# EAGLE design lichtenstein_pwm_v2 (EAGLE 9.2.1)

## Sheet 1 of 2
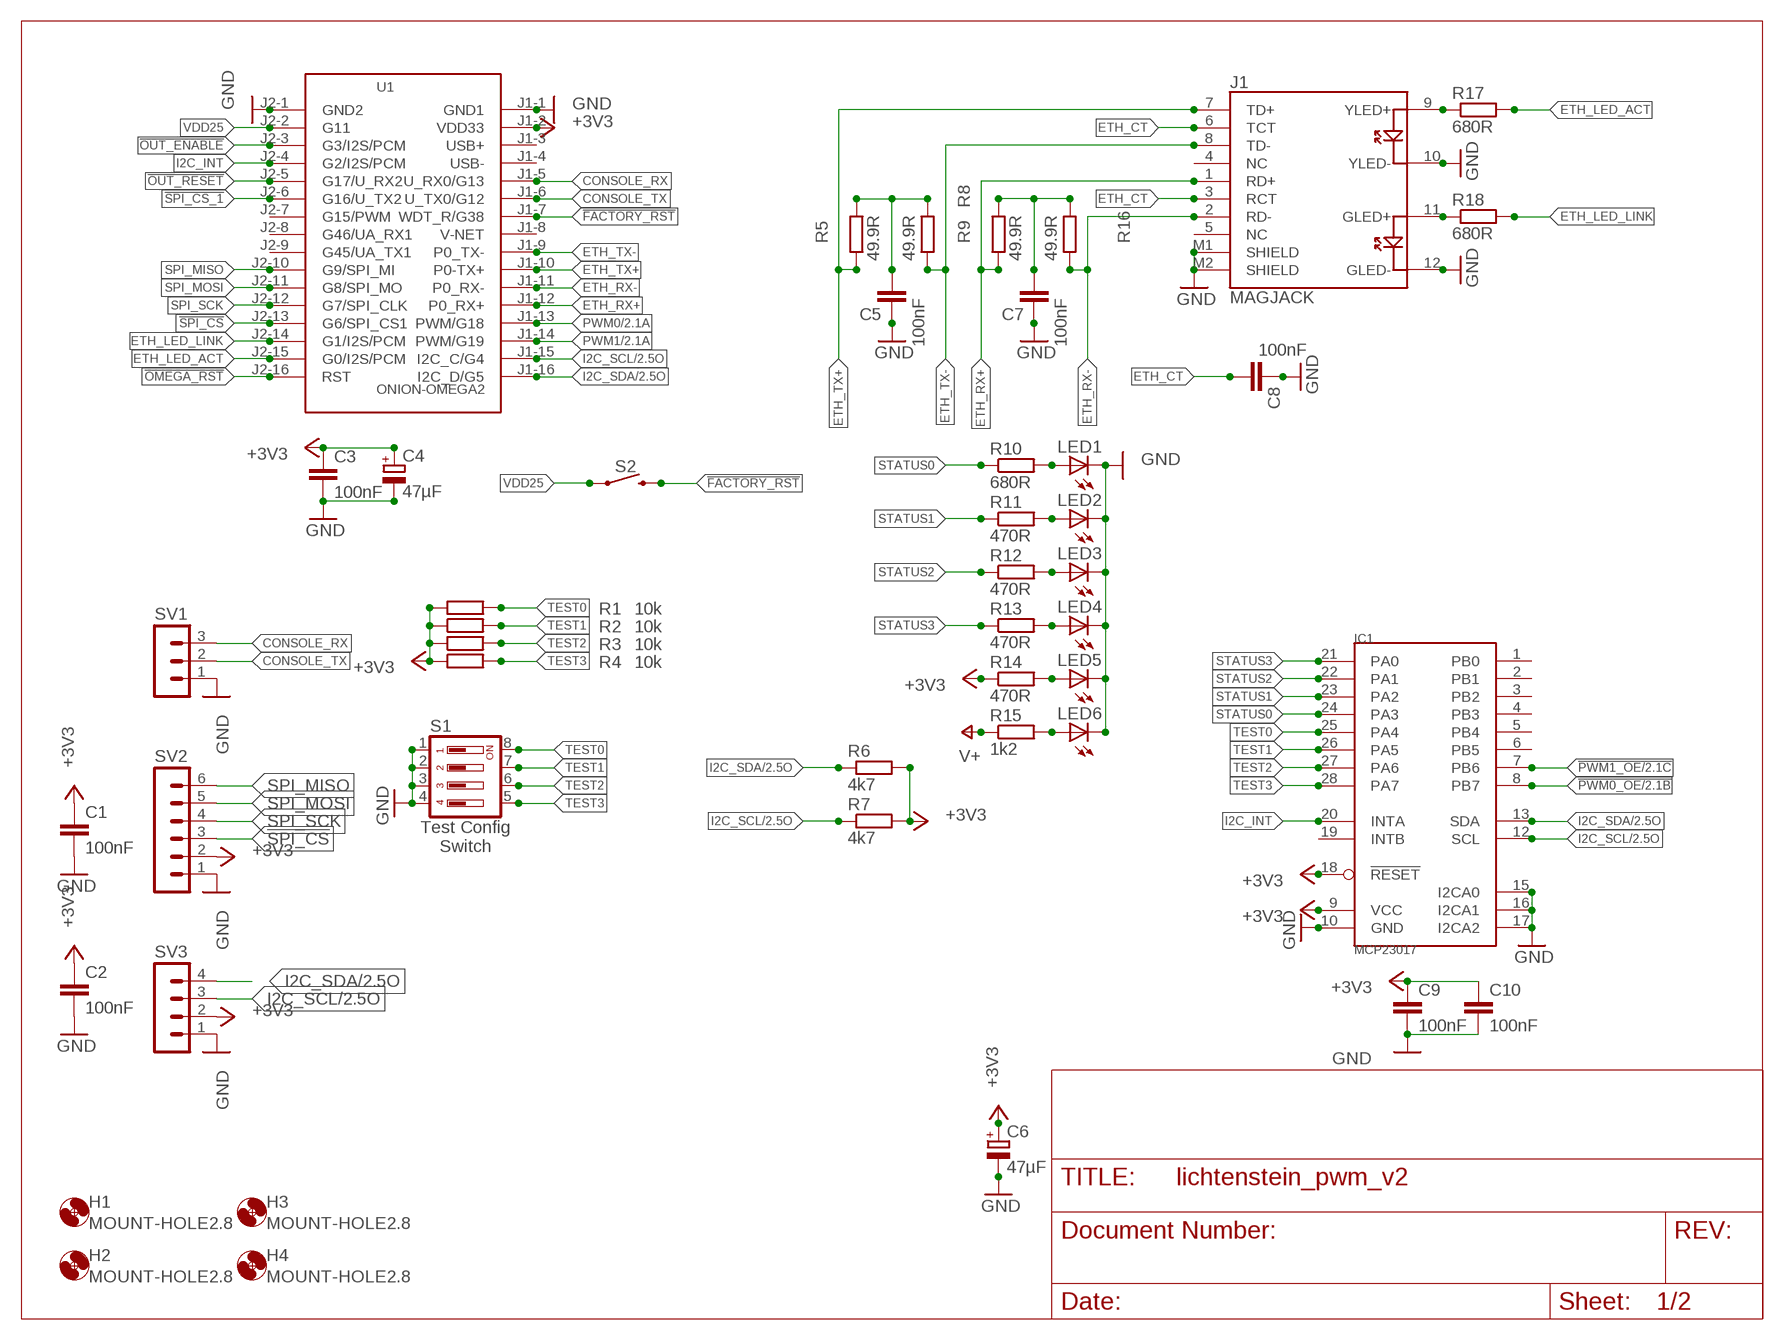
[diagram p0: schematic, sheet 1]

### Parts
C1  100nF  C-EUC0805  [C0805]
C2  100nF  C-EUC0805  [C0805]
C3  100nF  C-EUC0805  [C0805]
C4  47µF  CPOL-EUSMCC  [SMC_C]
C5  100nF  C-EUC0805  [C0805]
C6  47µF  CPOL-EUSMCC  [SMC_C]
C7  100nF  C-EUC0805  [C0805]
C8  100nF  C-EUC0805  [C0805]
C9  100nF  C-EUC0805  [C0805]
C10  100nF  C-EUC0805  [C0805]
H1  MOUNT-HOLE2.8  [2,8]
H2  MOUNT-HOLE2.8  [2,8]
H3  MOUNT-HOLE2.8  [2,8]
H4  MOUNT-HOLE2.8  [2,8]
IC1  MCP23017  MCP23017SOIC28  [SO28W]
J1  MAGJACK  [MAGJACK]
LED1  LEDCHIPLED_1206  [CHIPLED_1206]
LED2  LEDCHIPLED_1206  [CHIPLED_1206]
LED3  LEDCHIPLED_1206  [CHIPLED_1206]
LED4  LEDCHIPLED_1206  [CHIPLED_1206]
LED5  LEDCHIPLED_1206  [CHIPLED_1206]
LED6  LEDCHIPLED_1206  [CHIPLED_1206]
R1  10k  R-EU_M0805  [M0805]
R2  10k  R-EU_M0805  [M0805]
R3  10k  R-EU_M0805  [M0805]
R4  10k  R-EU_M0805  [M0805]
R5  49.9R  R-EU_M0805  [M0805]
R6  4k7  R-EU_M0805  [M0805]
R7  4k7  R-EU_M0805  [M0805]
R8  49.9R  R-EU_M0805  [M0805]
R9  49.9R  R-EU_M0805  [M0805]
R10  680R  R-EU_M0805  [M0805]
R11  470R  R-EU_M0805  [M0805]
R12  470R  R-EU_M0805  [M0805]
R13  470R  R-EU_M0805  [M0805]
R14  470R  R-EU_M0805  [M0805]
R15  1k2  R-EU_M0805  [M0805]
R16  49.9R  R-EU_M0805  [M0805]
R17  680R  R-EU_M0805  [M0805]
R18  680R  R-EU_M0805  [M0805]
S1  219-04  [CTS-219-04]
S2  MOMENTARY-SWITCH-SPST-PTH-6.0MM  [TACTILE_SWITCH_PTH_6.0MM]
SV1  MA03-1  [MA03-1]
SV2  MA06-1  [MA06-1]
SV3  MA04-1  [MA04-1]
U1  ONION-OMEGA2  [ONION-2MM-2X16]

### Nets
!FACTORY_RST: S2.3 U1.J1-7(WDT_R/G38)
!OMEGA_RST: U1.J2-16(RST)
!OUT_ENABLE: U1.J2-3(G3/I2S/PCM)
!OUT_RESET: U1.J2-5(G17/U_RX2)
!PWM0_OE: IC1.8(PB7) ; also sheet 2
!PWM1_OE: IC1.7(PB6) ; also sheet 2
!SPI_CS: SV2.3 U1.J2-13(G6/SPI_CS1)
!SPI_CS_1: U1.J2-6(G16/U_TX2)
+3V3: C1.1 C2.1 C3.1 C4.+ C6.+ C9.1 C10.1 IC1.9(VCC) IC1.18(!RESET) R1.1 R2.1 R3.1 R4.1 R6.2 R7.2 R14.1 SV2.2 SV3.2 U1.J1-2(VDD33) ; also sheet 2
CONSOLE_RX: SV1.3 U1.J1-5(U_RX0/G13)
CONSOLE_TX: SV1.2 U1.J1-6(U_TX0/G12)
ETH_CT: C8.2 J1.3(RCT) J1.6(TCT)
ETH_LED_ACT: R17.2 U1.J2-15(G0/I2S/PCM)
ETH_LED_LINK: R18.2 U1.J2-14(G1/I2S/PCM)
ETH_RX+: J1.1(RD+) R9.1 U1.J1-12(P0_RX+)
ETH_RX-: J1.2(RD-) R16.1 U1.J1-11(P0_RX-)
ETH_TX+: J1.7(TD+) R5.1 U1.J1-10(P0-TX+)
ETH_TX-: J1.8(TD-) R8.1 U1.J1-9(P0_TX-)
GND: C1.2 C2.2 C3.2 C4.- C5.1 C6.- C7.1 C8.1 C9.2 C10.2 IC1.10(GND) IC1.15(I2CA0) IC1.16(I2CA1) IC1.17(I2CA2) J1.10(YLED-) J1.12(GLED-) J1.M1(SHIELD) J1.M2(SHIELD) LED1.C LED2.C LED3.C LED4.C LED5.C LED6.C S1.1 S1.2 S1.3 S1.4 SV1.1 SV2.1 SV3.1 U1.J1-1(GND1) U1.J2-1(GND2) ; also sheet 2
I2C_INT: IC1.20(INTA) U1.J2-4(G2/I2S/PCM)
I2C_SCL: IC1.12(SCL) R7.1 SV3.3 U1.J1-15(I2C_C/G4) ; also sheet 2
I2C_SDA: IC1.13(SDA) R6.1 SV3.4 U1.J1-16(I2C_D/G5) ; also sheet 2
N$1: LED5.A R14.2
N$2: LED1.A R10.2
N$3: C5.2 R5.2 R8.2
N$4: J1.9(YLED+) R17.1
N$5: J1.11(GLED+) R18.1
N$6: C7.2 R9.2 R16.2
N$9: LED2.A R11.2
N$10: LED3.A R12.2
N$11: LED4.A R13.2
N$14: LED6.A R15.2
PWM0: U1.J1-13(PWM/G18) ; also sheet 2
PWM1: U1.J1-14(PWM/G19) ; also sheet 2
SPI_MISO: SV2.6 U1.J2-10(G9/SPI_MI)
SPI_MOSI: SV2.5 U1.J2-11(G8/SPI_MO)
SPI_SCK: SV2.4 U1.J2-12(G7/SPI_CLK)
STATUS0: IC1.24(PA3) R10.1
STATUS1: IC1.23(PA2) R11.1
STATUS2: IC1.22(PA1) R12.1
STATUS3: IC1.21(PA0) R13.1
TEST0: IC1.25(PA4) R1.2 S1.8
TEST1: IC1.26(PA5) R2.2 S1.7
TEST2: IC1.27(PA6) R3.2 S1.6
TEST3: IC1.28(PA7) R4.2 S1.5
V+: R15.1 ; also sheet 2
VDD25: S2.1 U1.J2-2(G11)
Unconnected: IC1.1(PB0) IC1.2(PB1) IC1.3(PB2) IC1.4(PB3) IC1.5(PB4) IC1.6(PB5) IC1.19(INTB) J1.4(NC) J1.5(NC) U1.J1-3(USB+) U1.J1-4(USB-) U1.J1-8(V-NET) U1.J2-7(G15/PWM) U1.J2-8(G46/UA_RX1) U1.J2-9(G45/UA_TX1)

### Notes on the sheet
- Test Config
  Switch

## Sheet 2 of 2
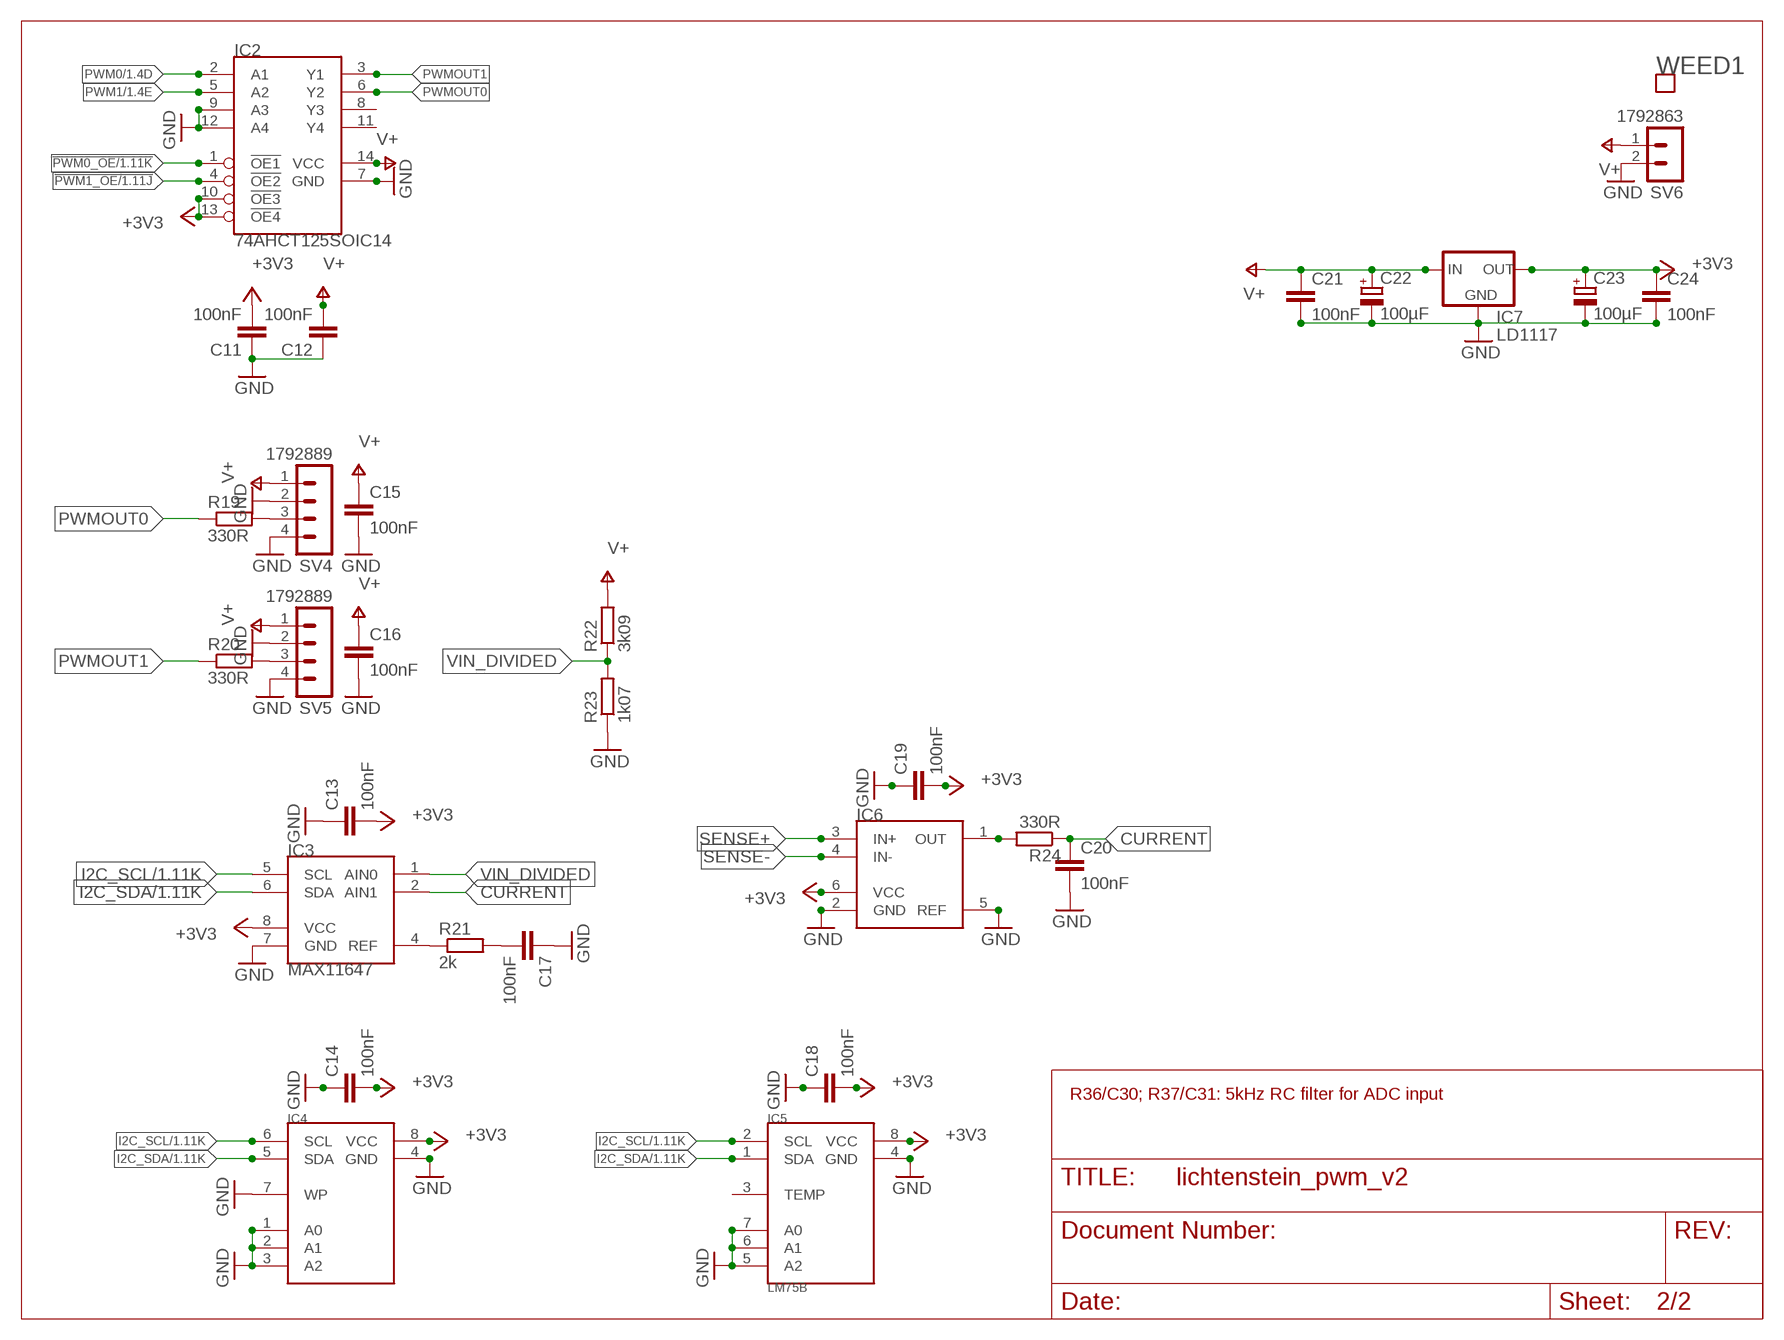
[diagram p1: schematic, sheet 2]

### Parts
C11  100nF  C-EUC0805  [C0805]
C12  100nF  C-EUC0805  [C0805]
C13  100nF  C-EUC0805  [C0805]
C14  100nF  C-EUC0805  [C0805]
C15  100nF  C-EUC0805  [C0805]
C16  100nF  C-EUC0805  [C0805]
C17  100nF  C-EUC0805  [C0805]
C18  100nF  C-EUC0805  [C0805]
C19  100nF  C-EUC0805  [C0805]
C20  100nF  C-EUC0805  [C0805]
C21  100nF  C-EUC0805  [C0805]
C22  100µF  CPOL-EUD  [PANASONIC_D]
C23  100µF  CPOL-EUCT7343  [CT7343]
C24  100nF  C-EUC0805  [C0805]
IC2  74AHCT125SOIC14  [SO14]
IC3  MAX11647  MAX11647UMAX-8  [UMAX8]
IC4  AT24C02DSOIC-8  [SOIC8]
IC5  LM75B  [SOIC8]
IC6  INA18120VVSOT-23  [SOT23-6L]
IC7  LD1117  LD1117TO-220  [TO220V]
R19  330R  R-EU_M0805  [M0805]
R20  330R  R-EU_M0805  [M0805]
R21  2k  R-EU_M0805  [M0805]
R22  3k09  R-EU_M0805  [M0805]
R23  1k07  R-EU_M0805  [M0805]
R24  330R  R-EU_M0805  [M0805]
SV4  1792889  [1792889]
SV5  1792889  [1792889]
SV6  1792863  [1792863]
WEED1  WEED  [DOINK]

### Nets
!PWM0_OE: IC2.1(!OE1) ; also sheet 1
!PWM1_OE: IC2.4(!OE2) ; also sheet 1
+3V3: C11.2 C13.2 C14.2 C18.2 C19.2 C23.+ C24.1 IC2.10(!OE3) IC2.13(!OE4) IC3.8(VCC) IC4.8(VCC) IC5.8(VCC) IC6.6(VCC) IC7.2(OUT) ; also sheet 1
CURRENT: C20.1 IC3.2(AIN1) R24.1
GND: C11.1 C12.1 C13.1 C14.1 C15.2 C16.2 C17.1 C18.1 C19.1 C20.2 C21.2 C22.- C23.- C24.2 IC2.7(GND) IC2.9(A3) IC2.12(A4) IC3.7(GND) IC4.1(A0) IC4.2(A1) IC4.3(A2) IC4.4(GND) IC4.7(WP) IC5.4(GND) IC5.5(A2) IC5.6(A1) IC5.7(A0) IC6.2(GND) IC6.5(REF) IC7.1(GND) R23.1 SV4.2 SV4.4 SV5.2 SV5.4 SV6.2 ; also sheet 1
I2C_SCL: IC3.5(SCL) IC4.6(SCL) IC5.2(SCL) ; also sheet 1
I2C_SDA: IC3.6(SDA) IC4.5(SDA) IC5.1(SDA) ; also sheet 1
N$7: R19.2 SV4.3
N$8: R20.2 SV5.3
N$12: IC3.4(REF) R21.1
N$13: C17.2 R21.2
N$21: IC6.1(OUT) R24.2
PWM0: IC2.2(A1) ; also sheet 1
PWM1: IC2.5(A2) ; also sheet 1
PWMOUT0: IC2.6(Y2) R19.1
PWMOUT1: IC2.3(Y1) R20.1
SENSE+: IC6.3(IN+)
SENSE-: IC6.4(IN-)
V+: C12.2 C15.1 C16.1 C21.1 C22.+ IC2.14(VCC) IC7.3(IN) R22.2 SV4.1 SV5.1 SV6.1 ; also sheet 1
VIN_DIVIDED: IC3.1(AIN0) R22.1 R23.2
Unconnected: IC2.8(Y3) IC2.11(Y4) IC5.3(TEMP)

### Notes on the sheet
- R36/C30; R37/C31: 5kHz RC filter for ADC input

## Library data of the parts
C1-C3 C5 C7-C21 C24 = rcl:C-EU: CAPACITOR, European symbol; MOUSER: 710-885012207072; SPICEPREFIX: C
C4 C6 = rcl:CPOL-EU: POLARIZED CAPACITOR, European symbol; MOUSER: 581-TAJC476K016SNJ; SPICEPREFIX: C
C22 = rcl:CPOL-EU: POLARIZED CAPACITOR, European symbol; MOUSER: 667-EEE-HC1C101XP; SPICEPREFIX: C
C23 = rcl:CPOL-EU: POLARIZED CAPACITOR, European symbol; MOUSER: 581-NOSD107M006; SPICEPREFIX: C
H1-H4 = holes:MOUNT-HOLE: MOUNTING HOLE with drill center marker
IC1 = lichtenstein_onion:MCP23017: MCP23017 – 16-Bit I2C I/O Expander with Serial Interface Footprint Proven Information <https://www.microchip.com/wwwproducts/en/MCP23017> Datasheet <http://ww1.microchip.com/downloads/en/DeviceDoc/20001952C.pdf>; MOUSER: 579-MCP23017-E/SO
IC2 = lichtenstein_onion:74AHCT125: UADRUPLE BUS BUFFER GATES WITH 3-STATE OUTPUTS Datasheet <http://www.ti.com/lit/ds/symlink/sn74ahct125.pdf>; MOUSER: 595-SN74AHCT125D
IC3 = lichtenstein_onion:MAX11647: Low-Power, 1-/2-Channel, I²C, 10-Bit ADC Datasheet <https://datasheets.maximintegrated.com/en/ds/MAX11646-MAX11647.pdf>; MOUSER: 700-MAX11647EUA
IC4 = lichtenstein_onion:AT24C02D: I2C-Compatible (2-wire) Serial EEPROM; 1-Kbit (128 x 8) or 2-Kbit (256 x 8) Footprint Proven Datasheet <http://ww1.microchip.com/downloads/en/DeviceDoc/Atmel-8871F-SEEPROM-AT24C01D-02D-Datasheet.pdf>; MOUSER: 556-AT24C02D-SSHM-T
IC5 = lichtenstein_onion:LM75B: Digital temperature sensor and thermal watchdog Datasheet <https://www.mouser.com/datasheet/2/302/LM75B-1126491.pdf>; MOUSER: 771-LM75BD118
IC6 = lichtenstein_onion:INA181: Bidirectional, Low- and High-Side Voltage Output, Current-Sense Amplifiers Datasheets <http://www.ti.com/lit/ds/symlink/ina181.pdf> Gain Options 20 V/V (INA181A1) 50 V/V (INA181A2) 100 V/V (INA181A3) 200 V/V (INA181A4); MOUSER: 595-INA181A1IDBVR
IC7 = lichtenstein_onion:LD1117: LD1117 Voltage Regulator; MOUSER: 490-VXO7803-500
J1 = SparkFun-Connectors:MAGJACK: MAGJACK: RJ-45 with LEDs This is a single port, RJ45 ethernet jacks with built in transformer (magnetics), status LEDs, and shielding. Here is the connector we sell at SparkFun: RJ45 Ethernet MagJack-Compatible <https://www.sparkfun.com/products/8534> (PRT-08534) Datasheet <http://www.sparkfun.com/datasheets/Prototyping/MagJack.pdf> It is used on this SparkFun product: SparkFun RJ45 MagJack Breakout <https://www.sparkfun.com/products/13021> (BOB-13021); PROD_ID: CONN-09556; SF_ID: PRT-08534
LED1 = led:LED: LED OSRAM: - CHIPLED LG R971, LG N971, LY N971, LG Q971, LY Q971, LO R971, LY R971 LH N974, LH R974 LS Q976, LO Q976, LY Q976 LO Q996 - Hyper CHIPLED LW Q18S LB Q993, LB Q99A, LB R99A - SideLED LS A670, LO A670, LY A670, LG A670, LP A670 LB A673, LV A673, LT A673, LW A673 LH A674 LY A675 LS A676, LA A676, LO A676, LY A676, LW A676 LS A679, LY A679, LG A679 - Hyper Micro SIDELED® LS Y876, LA Y876, LO Y876, LY Y876 LT Y87S - SmartLED LW L88C, LW L88S LB L89C, LB L89S, LG L890 LS L89K, LO L89K, LY L89K LS L896, LA L896, LO L896, LY L896 - TOPLED LS T670, LO T670, LY T670, LG T670, LP T670 LSG T670, LSP T670, LSY T670, LOP T670, LYG T670 LG T671, LOG T671, LSG T671 LB T673, LV T673, LT T673, LW T673 LH T674 LS T676, LA T676, LO T676, LY T676, LB T676, LH T676, LSB T676, LW T676 LB T67C, LV T67C, LT T67C, LS T67K, LO T67K, LY T67K, LW E67C LS E67B, LA E67B, LO E67B, LY E67B, LB E67C, LV E67C, LT E67C LW T67C LS T679, LY T679, LG T679 LS T770, LO T770, LY T770, LG T770, LP T770 LB T773, LV T773, LT T773, LW T773 LH T774 LS E675, LA E675, LY E675, LS T675 LS T776, LA T776, LO T776, LY T776, LB T776 LHGB T686 LT T68C, LB T68C - Hyper Mini TOPLED® LB M676 - Mini TOPLED Santana® LG M470 LS M47K, LO M47K, LY M47K Source: http://www.osram.convergy.de LUXEON: - LUMILED® LXK2-PW12-R00, LXK2-PW12-S00, LXK2-PW14-U00, LXK2-PW14-V00 LXK2-PM12-R00, LXK2-PM12-S00, LXK2-PM14-U00 LXK2-PE12-Q00, LXK2-PE12-R00, LXK2-PE12-S00, LXK2-PE14-T00, LXK2-PE14-U00 LXK2-PB12-K00, LXK2-PB12-L00, LXK2-PB12-M00, LXK2-PB14-N00, LXK2-PB14-P00, LXK2-PB14-Q00 LXK2-PR12-L00, LXK2-PR12-M00, LXK2-PR14-Q00, LXK2-PR14-R00 LXK2-PD12-Q00, LXK2-PD12-R00, LXK2-PD12-S00 LXK2-PH12-R00, LXK2-PH12-S00 LXK2-PL12-P00, LXK2-PL12-Q00, LXK2-PL12-R00 Source: www.luxeon.com KINGBRIGHT: KA-3528ASYC Source: www.kingbright.com; MOUSER: 604-APTR3216SRCPRV
LED2-LED6 = led:LED: LED OSRAM: - CHIPLED LG R971, LG N971, LY N971, LG Q971, LY Q971, LO R971, LY R971 LH N974, LH R974 LS Q976, LO Q976, LY Q976 LO Q996 - Hyper CHIPLED LW Q18S LB Q993, LB Q99A, LB R99A - SideLED LS A670, LO A670, LY A670, LG A670, LP A670 LB A673, LV A673, LT A673, LW A673 LH A674 LY A675 LS A676, LA A676, LO A676, LY A676, LW A676 LS A679, LY A679, LG A679 - Hyper Micro SIDELED® LS Y876, LA Y876, LO Y876, LY Y876 LT Y87S - SmartLED LW L88C, LW L88S LB L89C, LB L89S, LG L890 LS L89K, LO L89K, LY L89K LS L896, LA L896, LO L896, LY L896 - TOPLED LS T670, LO T670, LY T670, LG T670, LP T670 LSG T670, LSP T670, LSY T670, LOP T670, LYG T670 LG T671, LOG T671, LSG T671 LB T673, LV T673, LT T673, LW T673 LH T674 LS T676, LA T676, LO T676, LY T676, LB T676, LH T676, LSB T676, LW T676 LB T67C, LV T67C, LT T67C, LS T67K, LO T67K, LY T67K, LW E67C LS E67B, LA E67B, LO E67B, LY E67B, LB E67C, LV E67C, LT E67C LW T67C LS T679, LY T679, LG T679 LS T770, LO T770, LY T770, LG T770, LP T770 LB T773, LV T773, LT T773, LW T773 LH T774 LS E675, LA E675, LY E675, LS T675 LS T776, LA T776, LO T776, LY T776, LB T776 LHGB T686 LT T68C, LB T68C - Hyper Mini TOPLED® LB M676 - Mini TOPLED Santana® LG M470 LS M47K, LO M47K, LY M47K Source: http://www.osram.convergy.de LUXEON: - LUMILED® LXK2-PW12-R00, LXK2-PW12-S00, LXK2-PW14-U00, LXK2-PW14-V00 LXK2-PM12-R00, LXK2-PM12-S00, LXK2-PM14-U00 LXK2-PE12-Q00, LXK2-PE12-R00, LXK2-PE12-S00, LXK2-PE14-T00, LXK2-PE14-U00 LXK2-PB12-K00, LXK2-PB12-L00, LXK2-PB12-M00, LXK2-PB14-N00, LXK2-PB14-P00, LXK2-PB14-Q00 LXK2-PR12-L00, LXK2-PR12-M00, LXK2-PR14-Q00, LXK2-PR14-R00 LXK2-PD12-Q00, LXK2-PD12-R00, LXK2-PD12-S00 LXK2-PH12-R00, LXK2-PH12-S00 LXK2-PL12-P00, LXK2-PL12-Q00, LXK2-PL12-R00 Source: www.luxeon.com KINGBRIGHT: KA-3528ASYC Source: www.kingbright.com; MOUSER: 604-APTR3216SGC
R1-R4 = rcl:R-EU_: RESISTOR, European symbol; MOUSER: 652-CR0805FX-1002ELF; SPICEPREFIX: R
R5 R9 R16 = rcl:R-EU_: RESISTOR, European symbol; MOUSER: 652-CR0805FX-49R9ELF; SPICEPREFIX: R
R6-R8 = rcl:R-EU_: RESISTOR, European symbol; MOUSER: 652-CR0805-FX4701GLF; SPICEPREFIX: R
R10 = rcl:R-EU_: RESISTOR, European symbol; MOUSER: 667-ERJ-6ENF6800V; SPICEPREFIX: R
R11-R14 = rcl:R-EU_: RESISTOR, European symbol; MOUSER: 652-CR0805JW-471ELF; SPICEPREFIX: R
R15 = rcl:R-EU_: RESISTOR, European symbol; MOUSER: 755-ESR10EZPJ122; SPICEPREFIX: R
R17 R18 = rcl:R-EU_: RESISTOR, European symbol; MOUSER: 652-CR0805-FX6800GLF; SPICEPREFIX: R
R19 R20 R24 = rcl:R-EU_: RESISTOR, European symbol; MOUSER: 71-CRCW0805330RFKEAC; SPICEPREFIX: R
R21 = rcl:R-EU_: RESISTOR, European symbol; MOUSER: 667-ERJ-6ENF2001V; SPICEPREFIX: R
R22 = rcl:R-EU_: RESISTOR, European symbol; MOUSER: 652-CR0805FX-3091ELF; SPICEPREFIX: R
R23 = rcl:R-EU_: RESISTOR, European symbol; MOUSER: 652-CR0805FX-1071ELF; SPICEPREFIX: R
S1 = switch-dil:219-04*: Surface Mount DIP Switch Series 219 SMT CTS Electronic Components Sourc: www.ctscorp.com; MOUSER: 774-219-4LPS; OC_FARNELL: unknown; OC_NEWARK: unknown
S2 = SparkFun-Switches:MOMENTARY-SWITCH-SPST: Momentary Switch (Pushbutton) - SPST Normally-open (NO) SPST momentary switches (buttons, pushbuttons). Variants PTH-12MM - 12mm square, through-hole Momentary Pushbutton Switch - 12mm Square <https://www.sparkfun.com/products/9190> (COM-09190) PTH-6.0MM, PTH-6.0MM-KIT - 6.0mm square, through-hole Mini Pushbutton Switch <https://www.sparkfun.com/products/97> (COM-00097) KIT package intended for soldering kit's - only one side of pads' copper is exposed. PTH-RIGHT-ANGLE-KIT - Right-angle, through-hole Right Angle Tactile Button <https://www.sparkfun.com/products/10791> - Used on SparkFun BigTime Watch Kit <https://www.sparkfun.com/products/11734> SMD-12MM - 12mm square, surface-mount Tactile Button - SMD (12mm) <https://www.sparkfun.com/products/12993> (COM-12993) Used on SparkFun PicoBoard <https://www.sparkfun.com/products/11888> SMD-4.5MM - 4.5mm Square Trackball Switch Used on SparkFun Blackberry Trackballer Breakout <https://www.sparkfun.com/products/13169> SMD-4.6MMX2.8MM - 4.60mm x 2.80mm, surface mount Used on SparkFun SAMD21 Mini Breakout <https://www.sparkfun.com/products/13664> SMD-5.2MM, SMD-5.2-REDUNDANT - 5.2mm square, surface-mount Mini Pushbutton Switch - SMD <https://www.sparkfun.com/products/8720> (COM-08720) Used on Arduino Pro Mini <https://www.sparkfun.com/products/11114> REDUNDANT package connects both switch circuits together SMD-6.0X3.5MM - 6.0 x 3.5mm, surface mount Momentary Reset Switch SMD <https://www.sparkfun.com/products/8229> (COM-08229) SMD-6.2MM-TALL - 6.2mm square, surface mount Tactile Button - SMD (6mm) <https://www.sparkfun.com/products/12992> Used on SparkFun Digital Sandbox <https://www.sparkfun.com/products/12651> SMD-RIGHT-ANGLE - Right-angle, surface mount Used on SparkFun Block for Intel® Edison - Arduino <https://www.sparkfun.com/products/13036>; MOUSER: 612-TL1105B; PROD_ID: SWCH-08441; SF_SKU: COM-00097
SV1 = con-lstb:MA03-1: PIN HEADER; OC_FARNELL: unknown; OC_NEWARK: unknown
SV2 = con-lstb:MA06-1: PIN HEADER; OC_FARNELL: unknown; OC_NEWARK: unknown
SV3 = con-lstb:MA04-1: PIN HEADER; OC_FARNELL: unknown; OC_NEWARK: unknown
SV4 SV5 = lichtenstein_onion:1792889; MOUSER: 651-1792889
SV6 = lichtenstein_onion:1792863: PCB terminal block - PTS 1,5/ 2-5,0-H - 1792863 Footprint Proven Information <https://www.phoenixcontact.com/online/portal/us?uri=pxc-oc-itemdetail:pid=1792863&library=usen&tab=1>; MOUSER: 651-1792863
U1 = lichtenstein_onion:ONION-OMEGA2: Onion Omega Footprint Proven; MOUSER: 353-OM-O2P
WEED1 = lichtenstein_onion:WEED

## Net classes
0 default: width 0.203 mm

## Board
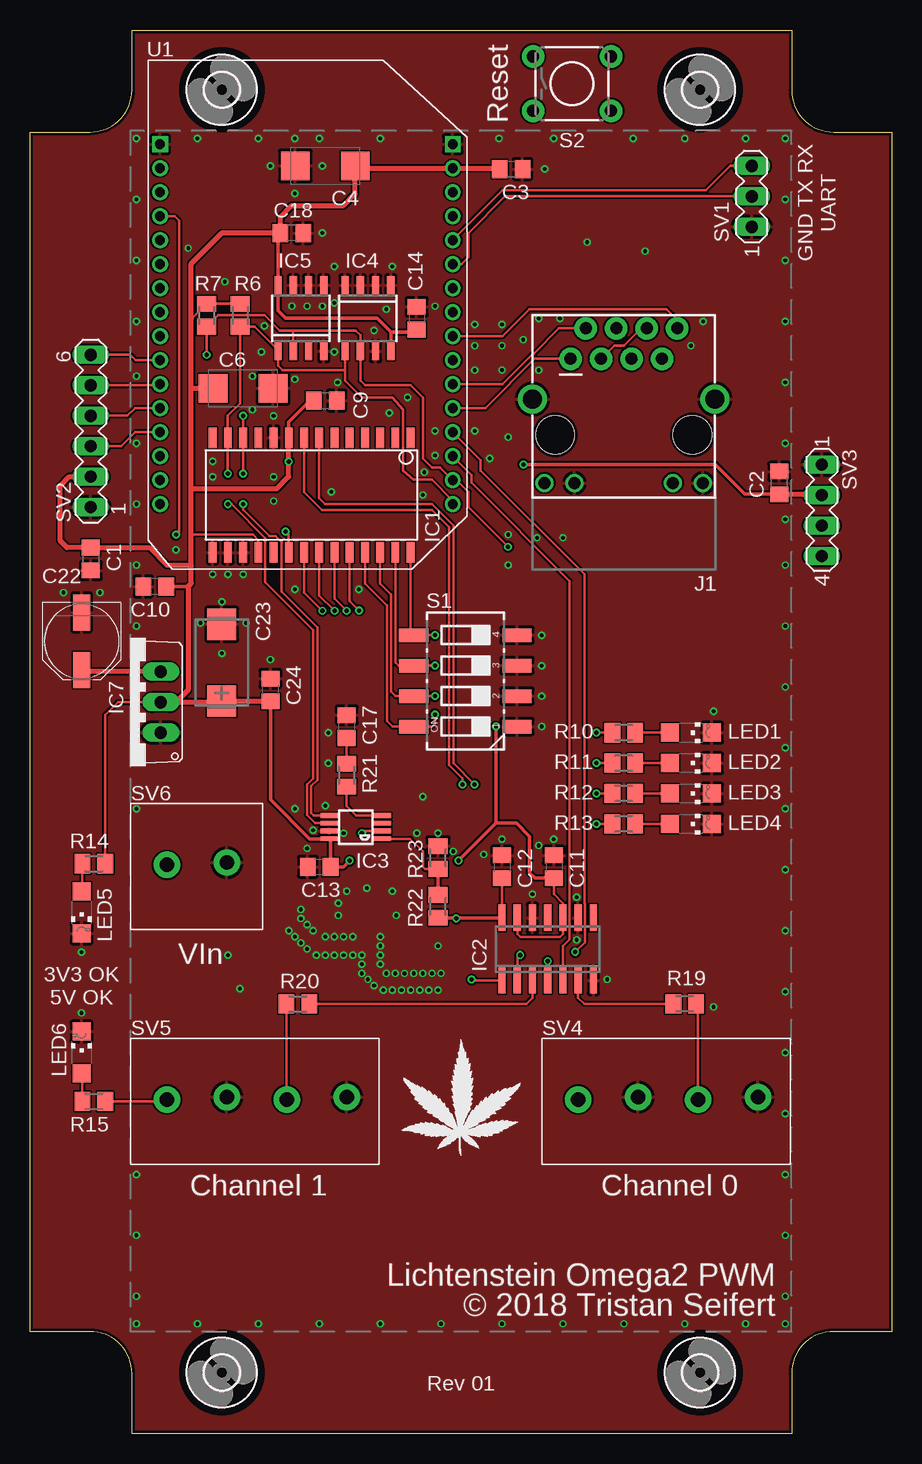
[diagram p2: board, top side]
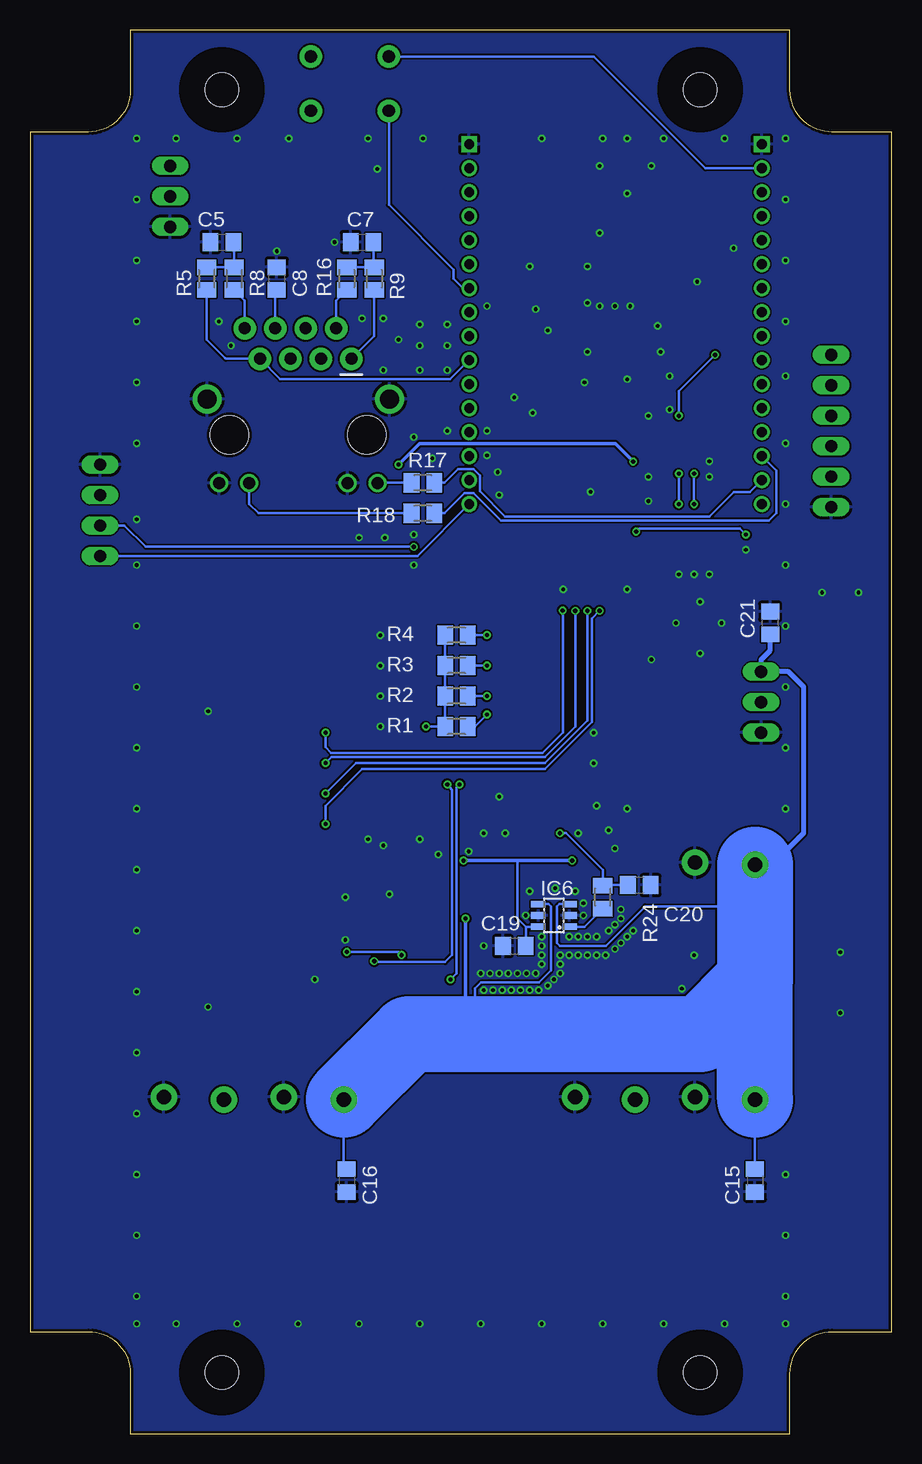
[diagram p3: board, bottom side, seen from below]

Size 71.87 x 117 mm. Coordinates in mm from the lower left corner, seen from the top.
Outline: 0,8.5 0,108.5 5,108.5 arc90 8.5,112 8.5,117 63.5,117 63.5,112 arc90 67,108.5 71.87,108.5 71.87,8.5 67,8.5 arc90 63.5,5 63.5,0 8.5,0 8.5,5 arc90 5,8.5 0,8.5
Copper layers (1*16): Top 0.035mm / dielectric 1.5mm / Bottom 0.035mm
Design rules "dirt_cheap_dirty_boards.v1.1": minimum track width 6mil, minimum drill 12mil, track to track 6mil, track to pad 6mil, pad to pad 6mil, via to via 6mil, smd to smd 0mil, copper to edge 10mil, drill to drill 10mil, minimum pad ring 10mil, minimum via ring 6mil, stop-mask expansion 2mil, vias tented up to drill 25mil, thermal gap 10mil

### Footprints (pad centres in the part's own frame; a part is rotated, then mirrored left to right if it is on the bottom)
C0805 = smd 1.3 x 1.5: 1 -0.95,0; 2 0.95,0
SMC_C = smd 2.4 x 2.4: + -2.5,0; - 2.5,0
PANASONIC_D = smd 3 x 1.4: + 2.4,0; - -2.4,0
CT7343 = smd 2.6 x 2.4: + -3.2,0; - 3.2,0
2,8 = hole 2.8: 0,0
SO28W = smd 0.65 x 1.7: 1 -7.62,-4.78; 2 -6.35,-4.78; 3 -5.08,-4.78; 4 -3.81,-4.78; 5 -2.54,-4.78; 6 -1.27,-4.78; 7 0,-4.78; 8 1.27,-4.78; 9 2.54,-4.78; 10 3.81,-4.78; 11 5.08,-4.78; 12 6.35,-4.78; 13 7.62,-4.78; 14 8.89,-4.78; 15 8.89,4.78; 16 7.62,4.78; 17 6.35,4.78; 18 5.08,4.78; 19 3.81,4.78; 20 2.54,4.78; 21 1.27,4.78; 22 0,4.78; 23 -1.27,4.78; 24 -2.54,4.78; 25 -3.81,4.78; 26 -5.08,4.78; 27 -6.35,4.78; 28 -7.62,4.78
SO14 = smd 0.6 x 2.2: 1 -3.81,-2.6; 2 -2.54,-2.6; 3 -1.27,-2.6; 4 0,-2.6; 5 1.27,-2.6; 6 2.54,-2.6; 7 3.81,-2.6; 8 3.81,2.6; 9 2.54,2.6; 10 1.27,2.6; 11 0,2.6; 12 -1.27,2.6; 13 -2.54,2.6; 14 -3.81,2.6
UMAX8 = smd 0.4 x 1.5: 1 -0.975,-2.175; 2 -0.325,-2.175; 3 0.325,-2.175; 4 0.975,-2.175; 5 0.975,2.175; 6 0.325,2.175; 7 -0.325,2.175; 8 -0.975,2.175
SOIC8 = smd 0.6 x 1.5: 1 -1.905,-2.75; 2 -0.635,-2.75; 3 0.635,-2.75; 4 1.905,-2.75; 5 1.905,2.75; 6 0.635,2.75; 7 -0.635,2.75; 8 -1.905,2.75
SOT23-6L = smd 0.55 x 1.2: 1 -0.95,-1.3; 2 0,-1.3; 3 0.95,-1.3; 4 0.95,1.3; 5 0,1.3; 6 -0.95,1.3
TO220V = drill 1.016 long: 1 -2.54,-2.54; 2 0,-2.54; 3 2.54,-2.54
MAGJACK = drill 1 pad 1.88: 1 3.175,17.445; 2 4.445,19.985; 3 5.715,17.445; 4 6.985,19.985; 5 8.255,17.445; 6 9.525,19.985; 7 10.795,17.445; 8 12.065,19.985 | drill 1 pad 1.27: 9 1,7.1; 10 3.5,7.1; 11 11.7,7.1; 12 14.2,7.1 | drill 1.6 pad 2.184: M1 0,14.1; M2 15.2,14.1 | hole 3.2: 1.905,11.095; 13.335,11.095
CHIPLED_1206 = smd 1.5 x 1.5: A 0,-1.75; C 0,1.75
M0805 = smd 1.3 x 1.6: 1 -0.95,0; 2 0.95,0
CTS-219-04 = smd 1.13 x 2.44: 1 -3.81,-4.3; 2 -1.27,-4.3; 3 1.27,-4.3; 4 3.81,-4.3; 5 3.81,4.3; 6 1.27,4.3; 7 -1.27,4.3; 8 -3.81,4.3
TACTILE_SWITCH_PTH_6.0MM = drill 1.016 pad 1.88: 1 -3.251,2.261; 2 3.251,2.261; 3 -3.251,-2.261; 4 3.251,-2.261
MA03-1 = drill 1.016 long: 1 -2.54,0; 2 0,0; 3 2.54,0
MA06-1 = drill 1.016 long: 1 -6.35,0; 2 -3.81,0; 3 -1.27,0; 4 1.27,0; 5 3.81,0; 6 6.35,0
MA04-1 = drill 1.016 long: 1 -3.81,0; 2 -1.27,0; 3 1.27,0; 4 3.81,0
1792889 = drill 1.2 pad 2.2: 1 -7.62,-0.1; 2 -2.62,0.1; 3 2.38,-0.1; 4 7.38,0.1
1792863 = drill 1.2 pad 2.2: 1 0,-0.1; 2 5,0.1
ONION-2MM-2X16 = drill 0.8 square: J1-1 12.4,14; J2-1 -12,14 | drill 0.8: J1-2 12.4,12; J1-3 12.4,10; J1-4 12.4,8; J1-5 12.4,6; J1-6 12.4,4; J1-7 12.4,2; J1-8 12.4,0; J1-9 12.4,-2; J1-10 12.4,-4; J1-11 12.4,-6; J1-12 12.4,-8; J1-13 12.4,-10; J1-14 12.4,-12; J1-15 12.4,-14; J1-16 12.4,-16; J2-2 -12,12; J2-3 -12,10; J2-4 -12,8; J2-5 -12,6; J2-6 -12,4; J2-7 -12,2; J2-8 -12,0; J2-9 -12,-2; J2-10 -12,-4; J2-11 -12,-6; J2-12 -12,-8; J2-13 -12,-10; J2-14 -12,-12; J2-15 -12,-14; J2-16 -12,-16

### Placement (x,y rotation side)
C1  5.07,72.9 270 top
C2  62.47,79.25 90 top
C3  40.12,105.41 0 top
C4  24.62,105.67 180 top
C5  55.87,99.32 0 bottom
C6  17.77,87.13 0 top
C7  44.18,99.32 0 bottom
C8  51.29,96.27 270 bottom
C9  24.62,86.11 0 top
C10  10.4,70.62 180 top
C11  43.67,47.25 270 top
C12  39.36,47.25 270 top
C13  24.12,47.25 0 top
C14  32.24,92.97 270 top
C15  11.42,21.09 270 bottom
C16  45.45,21.09 270 bottom
C17  26.4,58.93 270 top
C18  21.83,100.08 180 top
C19  31.48,40.64 0 bottom
C20  21.07,45.72 0 bottom
C21  10.15,67.57 90 bottom
C22  4.3,66.04 270 top
C23  15.99,64.27 90 top
C24  20.05,61.98 90 top
H1  15.99,112.02 0 top
H2  55.87,112.02 0 top
H3  15.99,5.08 0 top
H4  55.87,5.08 0 top
IC1  24.12,78.24 180 top
IC2  43.17,40.39 0 top
IC3  27.16,50.55 90 top
IC4  28.18,92.97 180 top
IC5  22.59,92.97 0 top
IC6  28.18,43.18 90 bottom
IC7  8.37,60.96 90 top
J1  41.9,72.14 0 top
LED1  55.1,58.42 270 top
LED2  55.1,55.88 270 top
LED3  55.1,53.34 270 top
LED4  55.1,50.8 270 top
LED5  4.3,43.44 180 top
LED6  4.3,31.75 0 top
R1  36.31,58.93 0 bottom
R2  36.31,61.47 0 bottom
R3  36.31,64.01 0 bottom
R4  36.31,66.55 0 bottom
R5  57.14,96.27 90 bottom
R6  17.51,93.22 90 top
R7  14.72,93.22 90 top
R8  54.85,96.27 90 bottom
R9  43.17,96.27 90 bottom
R10  49.52,58.42 0 top
R11  49.52,55.88 0 top
R12  49.52,53.34 0 top
R13  49.52,50.8 0 top
R14  5.32,47.5 180 top
R15  5.32,27.69 180 top
R16  45.45,96.27 90 bottom
R17  39.1,79.25 0 bottom
R18  39.1,76.71 0 bottom
R19  54.6,35.82 0 top
R20  22.34,35.82 180 top
R21  26.4,54.87 90 top
R22  34.02,43.95 270 top
R23  34.02,48.01 270 top
R24  24.12,44.71 270 bottom
S1  36.31,62.74 90 top
S2  45.2,112.53 0 top
SV1  60.18,103.13 90 top
SV2  5.07,83.57 90 top
SV3  66.03,76.97 270 top
SV4  53.33,27.94 0 top
SV5  19.04,27.94 0 top
SV6  11.42,47.5 0 top
U1  22.85,93.48 0 top
WEED1  30.97,23.12 0 top

### Tracks (layer width: path | path; a pad name or v marks a point on that pad's centre or on a via)
!FACTORY_RST
  Bottom 0.203: S2.3 41.95,102.42 36.56,97.03 36.56,96.27 35.77,95.48 U1.J1-7
!PWM0_OE  (via drill 0.35)
  Top 0.203: IC1.8 22.85,78.49 24.37,76.97 33.51,76.97 34.94,75.54 34.94,55.73 36.05,54.61 v36.05,54.11 | v36.82,37.85 36.88,37.79 IC2.1
  Bottom 0.203: v36.05,54.11 36.31,53.85 36.31,38.36 v36.82,37.85
!PWM1_OE  (via drill 0.35)
  Top 0.203: IC1.7 24.12,77.98 24.62,77.47 33.51,77.47 35.29,75.7 35.29,55.88 v37.07,54.11 | v43.17,39.37 IC2.4
  Bottom 0.203: v37.07,54.11 36.66,53.63 36.66,39.88 37.25,39.3 43.09,39.3 v43.17,39.37
!SPI_CS
  Top 0.203: U1.J2-13 8.78,83.48 7.61,82.3 SV2.3
+3V3  (via drill 0.35)
  Top 0.203: R6.2 R7.2 13.51,92.97 13.45,92.97 | IC2.13 40.63,41.66 40.88,41.41 44.18,41.41 44.44,41.66 IC2.10 44.44,44.2 43.67,44.96 C11.2 | 13.45,74.93 18.59,74.93 19.04,74.49 IC1.18 | IC7.2 7.35,60.96 6.27,59.88 R14.1
  Top 0.305: C4.+ 28.02,105.48 | 39.11,105.48 C3.1 | C18.2 20.69,100.02 IC5.8 20.69,93.6 21.32,92.97 28.94,92.97 30.09,91.83 | v38.85,58.93 38.85,50.88 | C10.1 13.19,70.62 | v26.66,47.76 26.15,47.25 C13.2 25.07,49.5 IC3.8 23.31,49.58 20.05,52.84 C24.1 | 30.09,91.83 IC4.8 | v41.13,80.78 57.14,80.78 59.61,78.3 C2.1 | IC1.9 21.58,83.06 21.58,84.33 23.35,86.11 C9.1 | C14.2 32.05,91.83 30.09,91.83 | v35.73,47.76 38.85,50.88 | 38.85,50.88 40.55,50.88 41.64,49.79 41.64,46.74 42.08,46.3 C11.2
  Top 0.406: 28.02,105.48 U1.J1-2 39.11,105.48 | 13.45,78.74 20.56,78.74 21.58,79.76 v21.58,81.03 21.58,83.06 | SV2.2 3.29,79.76 2.53,79 2.53,74.43 3.1,73.85 C1.1 9.96,73.85 11.42,72.39 13.45,72.39 | C2.1 65.96,78.3 SV3.2 | 13.45,72.39 13.45,70.87 13.19,70.62 13.19,61.98 12.18,60.96 IC7.2 15.89,60.96 C23.+ 20.02,61.07 C24.1 | 13.45,72.39 13.45,74.93 13.45,78.74 | 13.45,78.74 13.45,87.13 | 13.45,87.13 13.45,92.97 13.45,97.54 15.99,100.08 C18.2 20.88,101.42 21.83,102.37 26.15,102.37 27.12,103.34 C4.+ | 13.45,87.13 C6.+
  Bottom 0.203: R4.1 R3.1 R2.1 R1.1 v38.85,58.93 | IC6.6 30.53,42.23 | 30.53,42.23 31.23,42.93 31.23,47.76 | 30.53,42.23 C19.2
  Bottom 0.305: v26.66,47.76 31.23,47.76 v35.73,47.76 | v21.58,81.03 23.06,82.52 39.39,82.52 v41.13,80.78
CONSOLE_RX
  Top 0.203: U1.J1-5 39.41,103.64 56.37,103.64 58.41,105.67 SV1.3
CONSOLE_TX
  Top 0.203: U1.J1-6 35.99,97.48 36.56,98.05 36.56,100.08 39.61,103.13 SV1.2
CURRENT  (via drill 0.35)
  Top 0.203: IC3.2 27.86,50.23 v27.67,50.04
  Bottom 0.203: v27.67,50.04 27.16,50.04 24.12,46.99 R24.1 24.05,45.72 C20.1
ETH_CT
  Top 0.203: J1.3 48.71,90.68 49.52,90.68 50.96,92.13 J1.6
  Bottom 0.203: C8.2 51.42,95.19 J1.6
ETH_LED_ACT
  Bottom 0.203: U1.J2-15 11.83,78.49 13.19,78.49 15.23,76.46 32.24,76.46 34.34,78.55 34.34,79.85 34.87,80.38 36.19,80.38 37.32,79.25 R17.2
ETH_LED_LINK
  Bottom 0.203: U1.J2-14 9.64,80.27 9.64,76.71 10.25,76.1 32.59,76.1 34.87,78.38 35.62,78.38 37.29,76.71 R18.2
ETH_RX+
  Top 0.203: U1.J1-12 37.96,85.48 42.07,89.59 J1.1
  Bottom 0.203: R9.1 43.17,91.49 J1.1
ETH_RX-
  Top 0.203: U1.J1-11 39.39,87.48 41.9,89.99 41.97,89.99 44.1,92.13 J1.2
  Bottom 0.203: R16.1 46.34,94.43 J1.2
ETH_TX+
  Bottom 0.203: U1.J1-10 36.83,87.89 50.99,87.89 J1.7 55.53,89.59 55.61,89.67 57.14,91.19 R5.1
ETH_TX-
  Top 0.203: U1.J1-9 39.39,91.48 41.64,93.73 53.07,93.73 53.96,92.84 J1.8
  Bottom 0.203: R8.1 53.96,94.43 J1.8
GND  (via drill 0.3)
  other vias: 8.88,107.95 13.96,107.95 19.04,107.95 29.2,107.95 39.1,107.95 43.67,107.95 54.6,107.95 50.28,107.95 59.68,107.95 62.98,107.95 62.98,102.87 62.98,97.79 62.98,92.71 62.98,87.63 62.98,82.55 62.98,76.2 62.98,72.39 62.98,57.15 62.98,52.07 62.98,46.99 62.98,41.91 62.98,36.83 62.98,31.75 62.98,26.67 62.98,21.59 62.98,16.51 62.98,11.43 62.98,9.15 59.68,9.15 54.6,9.15 49.52,9.15 44.44,9.15 39.36,9.15 34.28,9.15 29.2,9.15 24.12,9.15 19.04,9.15 13.96,9.15 8.88,9.15 8.88,11.43 8.88,16.51 8.88,21.59 8.88,52.07 8.88,57.15 8.88,62.23 8.88,67.31 8.88,72.39 8.88,77.47 8.88,88.14 8.88,97.79 8.88,82.55 8.88,92.71 8.88,102.87 24.12,107.95 51.29,98.56 46.47,99.32 37.07,90.68 42.4,92.97 44.18,92.97 37.07,88.65 39.36,88.65 39.36,90.68 41.13,91.19 56.12,92.71 55.1,90.68 42.4,88.65 37.07,92.46 39.36,92.46 25.39,94.24 25.39,90.17 32.24,50.04 43.67,49.53 41.9,44.96 4.3,40.14 4.3,35.06 20.31,84.84 20.31,79.76 22.08,52.07 15.99,69.35 25.13,78.49 15.23,71.63 16.5,71.63 17.77,71.63 23.1,48.77 20.05,64.52 18.02,67.57 14.21,67.57 15.23,79.76 15.23,81.03 29.96,85.09 21.83,93.98 23.1,93.98 24.37,93.98 16.24,96.02 22.08,70.36 24.88,55.88 32.75,53.09 45.58,44.71 45.58,41.15 48.12,37.85 35.29,48.52 26.15,50.04 23.61,50.3 24.62,52.33 57.01,35.56 57.01,60.2 25.72,43.18 27.67,39.88 29.2,39.12 34.02,40.64 30.21,45.22 26.4,45.22 28.08,45.47 16.5,39.88 17.51,37.09 28.69,37.34 15.99,65.03 37.83,48.26 42.4,49.03 42.66,64.01 42.66,61.47 42.66,58.93 42.91,105.41 26.91,41.41 26.15,41.41 25.39,41.41 24.62,41.41 29.2,41.41 29.2,40.64 29.2,39.88 25.72,44.2 30.54,43.18 22.59,43.69 23.61,41.91 23.1,42.42 22.59,42.93 26.91,39.88 26.15,39.88 25.39,39.88 24.62,39.88 23.86,39.88 23.1,40.39 22.59,40.9 22.08,41.41 21.58,41.91 27.67,39.12 29.7,38.36 27.67,38.36 28.18,37.85 28.69,91.95 29.7,93.73 25.39,97.29 5.83,70.11 2.78,70.11 22.08,87.89 24.37,105.67 22.08,103.38 20.05,105.67 22.08,107.95 39.86,83.06 33.77,83.57 33.77,81.54 62.98,62.23 62.98,67.31 30.21,97.29 44.44,74.68 42.28,74.68 32.75,78.24 39.86,72.39 29.45,36.96 30.21,36.96 30.97,36.96 31.74,36.96 32.5,36.96 33.26,36.96 34.02,36.96 30.47,38.36 31.23,38.36 31.99,38.36 32.75,38.36 33.51,38.36 34.28,38.36 32.88,80.14 31.48,86.36 18.53,85.35 18.53,88.14 19.29,90.17 19.54,92.33 38.34,81.28 39.86,74.93 37.07,83.57 12.18,73.66 13.19,98.81 34.02,50.04 39.36,49.53 42.66,66.55 20.31,77.73 24.88,58.42 27.42,70.36 25.64,87.63 33.77,93.98 24.37,100.08
  pour Top: -0.01,116.84 71.87,116.84 71.87,0 -0.01,0
  pour Bottom: -0.01,116.84 71.87,116.84 71.87,0 -0.01,0
I2C_INT  (via drill 0.35)
  Top 0.203: U1.J2-4 12.05,101.48 12.43,101.1 12.43,75.19 v12.18,74.93 | IC1.20 21.58,74.93 v21.32,75.19
  Bottom 0.203: v21.32,75.19 21.07,75.44 12.69,75.44 v12.18,74.93
I2C_SCL  (via drill 0.35)
  Top 0.203: v17.77,80.01 IC1.12 v17.77,84.84 | v17.77,77.47 17.77,77.02 19.97,74.81 20.48,74.81 21,74.3 21,70.17 23.96,67.21 23.96,54.47 23.46,53.96 23.46,51.72 23.65,51.53 IC3.5 | v39.86,73.92 36.56,77.22 36.56,78.49 35.58,79.48 U1.J1-15 34.2,80.52 33.51,80.52 32.75,81.28 32.75,86.36 31.74,87.38 27.93,87.38 27.55,87.76 IC4.6 27.55,91.57 27.16,91.95 21.83,91.95 | v14.74,89.92 14.74,92.25 R7.1 15.67,93.22 19.54,93.22 20.81,91.95 21.83,91.95 | IC5.2 21.96,91.83 21.83,91.95
  Bottom 0.203: v17.77,80.01 v17.77,77.47 | SV3.3 63.99,75.7 62.22,73.92 v39.86,73.92 | v14.74,89.92 17.77,86.9 v17.77,84.84
I2C_SDA  (via drill 0.35)
  Top 0.203: v16.5,77.47 16.81,77.47 19.62,74.67 19.62,70.97 23.61,66.98 23.61,54.61 23.1,54.11 23.1,51.57 23.79,50.88 IC3.6 | v16.5,80.01 IC1.13 16.5,84.84 17.51,85.86 R6.1 18.72,92.27 20.69,90.3 IC5.1 20.69,89.03 21.07,88.65 26.28,88.65 | U1.J1-16 35.25,77.77 33.51,79.51 31.96,79.51 31.1,80.27 31.1,85.35 30.21,86.36 27.67,86.36 26.28,87.76 26.28,88.65 | IC4.5 26.28,88.65
  Bottom 0.203: v16.5,77.47 v16.5,80.01 | U1.J1-16 39.57,73.16 SV3.4
N$1
  Top 0.203: R14.2 4.37,45.25 LED5.A
N$2
  Top 0.203: R10.2 LED1.A
N$3
  Bottom 0.203: R5.2 R8.2 54.85,99.25 C5.2
N$4
  Bottom 0.203: R17.1 42.88,79.25 J1.9
N$5
  Bottom 0.203: R18.1 52.82,76.71 53.6,77.49 J1.11
N$6
  Bottom 0.203: C7.2 43.23,97.29 R9.2 R16.2
N$7
  Top 0.203: R19.2 55.71,35.79 SV4.3
N$8
  Top 0.203: R20.2 21.39,27.87 SV5.3
N$9
  Top 0.203: R11.2 LED2.A
N$10
  Top 0.203: R12.2 LED3.A
N$11
  Top 0.203: R13.2 LED4.A
N$12
  Top 0.203: R21.1 26.4,52.33 27.21,51.53 IC3.4
N$13
  Top 0.203: C17.2 R21.2
N$14
  Top 0.203: LED6.A 4.37,29.94 R15.2
N$21
  Bottom 0.203: R24.2 25.64,42.23 IC6.1
PWM0  (via drill 0.35)
  Top 0.203: U1.J1-13 37.58,81.14 37.58,80.27 46.21,71.63 46.21,44.24 46.26,44.2 46.26,40.94 v45.45,40.14 | v40.88,39.88 40.63,39.63 IC2.2
  Bottom 0.203: v45.45,40.14 41.13,40.14 v40.88,39.88
PWM1
  Top 0.203: U1.J1-14 36.82,79.91 36.82,79.25 44.99,71.08 44.99,41.2 44.44,40.64 IC2.5
PWMOUT0
  Top 0.203: R19.1 46.21,35.82 45.71,36.33 IC2.6
PWMOUT1
  Top 0.203: IC2.3 41.9,36.33 41.39,35.82 R20.1
SENSE+
  Bottom 0.203: IC6.3 27.74,44.13 27.93,43.95 27.93,40.9 27.67,40.64 23.86,40.64 20.56,43.95 13.96,43.95
SENSE-
  Bottom 0.203: IC6.4 28.62,44.13 28.43,43.95 28.43,38.61 29.45,37.6 34.28,37.6 34.78,37.09 34.78,31.5
SPI_MISO
  Top 0.203: U1.J2-10 8.81,89.48 8.37,89.92 SV2.6
SPI_MOSI
  Top 0.203: SV2.5 10.75,87.38 U1.J2-11
SPI_SCK
  Top 0.203: U1.J2-12 8.75,85.48 8.11,84.84 SV2.4
STATUS0  (via drill 0.35)
  Top 0.203: IC1.24 26.66,69.41 v27.45,68.61 | v47.23,58.42 R10.1
  Bottom 0.203: v27.45,68.61 27.45,58.45 29.16,56.75 46.76,56.75 47.23,57.21 v47.23,58.42
STATUS1  (via drill 0.35)
  Top 0.203: IC1.23 25.39,69.6 v26.4,68.58 | R11.1 v47.23,55.88
  Bottom 0.203: v26.4,68.58 26.4,58.93 28.94,56.39 46.72,56.39 v47.23,55.88
STATUS2  (via drill 0.35)
  Top 0.203: IC1.22 24.12,69.85 v25.39,68.58 | v47.23,53.34 R12.1
  Bottom 0.203: v25.39,68.58 25.39,59.44 28.94,55.88 44.69,55.88 v47.23,53.34
STATUS3  (via drill 0.35)
  Top 0.203: IC1.21 22.85,70.11 v24.37,68.58 | v47.23,50.8 R13.1
  Bottom 0.203: v24.37,68.58 25.03,67.92 25.03,59.29 28.95,55.38 44.18,55.38 47.23,52.33 v47.23,50.8
TEST0  (via drill 0.35)
  Top 0.203: v33.77,59.95 33.77,59.19 33.51,58.93 S1.8 30.23,58.93 29.76,59.41 29.76,69.04 27.93,70.87 IC1.25
  Bottom 0.203: R1.2 34.78,58.93 v33.77,59.95
TEST1  (via drill 0.35)
  Top 0.203: v33.77,61.47 S1.7 30.48,61.47 30.11,61.85 30.11,69.96 29.2,70.87 IC1.26
  Bottom 0.203: v33.77,61.47 R2.2
TEST2  (via drill 0.35)
  Top 0.203: IC1.27 30.47,64.27 30.72,64.01 S1.6 v33.77,64.01
  Bottom 0.203: R3.2 v33.77,64.01
TEST3  (via drill 0.35)
  Top 0.203: IC1.28 31.74,66.82 S1.5 v33.77,66.55
  Bottom 0.203: R4.2 v33.77,66.55
V+  (via drill 0.35)
  Top 0.203: IC2.14 C12.2 | R15.1 11.26,27.69 SV5.1
  Top 0.305: IC2.14 35.61,42.99 | 35.61,42.99 v35.55,42.93 | R22.2 35.6,43 35.61,42.99
  Top 0.406: IC7.3 4.44,63.5 C22.+
  Bottom 0.203: C16.1 45.71,22.29 SV4.1 | C15.1 SV5.1
  Bottom 0.305: v35.55,42.93 35.55,33.28
  Bottom 0.406: SV6.1 9.99,47.4 7.35,50.04 7.35,62.23 8.62,63.5 IC7.3 10.91,64.52 10.15,65.28 C21.1
  Bottom 6.35: SV6.1 11.42,37.85 | SV4.1 40.27,33.28 35.55,33.28 15.99,33.28 11.42,37.85 | SV5.1 11.42,37.85
VDD25
  Bottom 0.203: U1.J2-2 15.54,105.48 24.85,114.79 S2.1
VIN_DIVIDED
  Top 0.203: IC3.1 31.7,49.58 32.75,48.52 32.75,47.25 32.94,47.06 R23.2
  Top 0.305: R23.2 R22.1

### Text on the board
tNames: Reset | GND TX RX / UART | VIn | 3V3 OK / 5V OK | Channel 1 | Channel 0 | Lichtenstein Omega2 PWM / © 2018 Tristan Seifert | Rev 01